# Altium schematic sheet Power_Supply.SchDoc: Power supply
size 420 x 297 mm; Author: G.K.; CompanyName: WUT; DrawnBy: G.K.; Organization: WUT ISE; Address1: Warsaw Univeristy of Technology; Address2: Nowowiejska 15/19; DocumentNumber: 5; Revision: -; SheetNumber: 5; SheetTotal: 6; EDA_Number: ARTIQ; Projet: Booster RF Power Amplifier; ModifiedBy: -; CreateDate: XX/XX/XXXX; CheckedDate: -; Title2: & Power Good detector v1.6; DivGrp: ISE; Designer: G.K.; ModifiedDate: -; ProjectName: Booster RF Power Amplifier
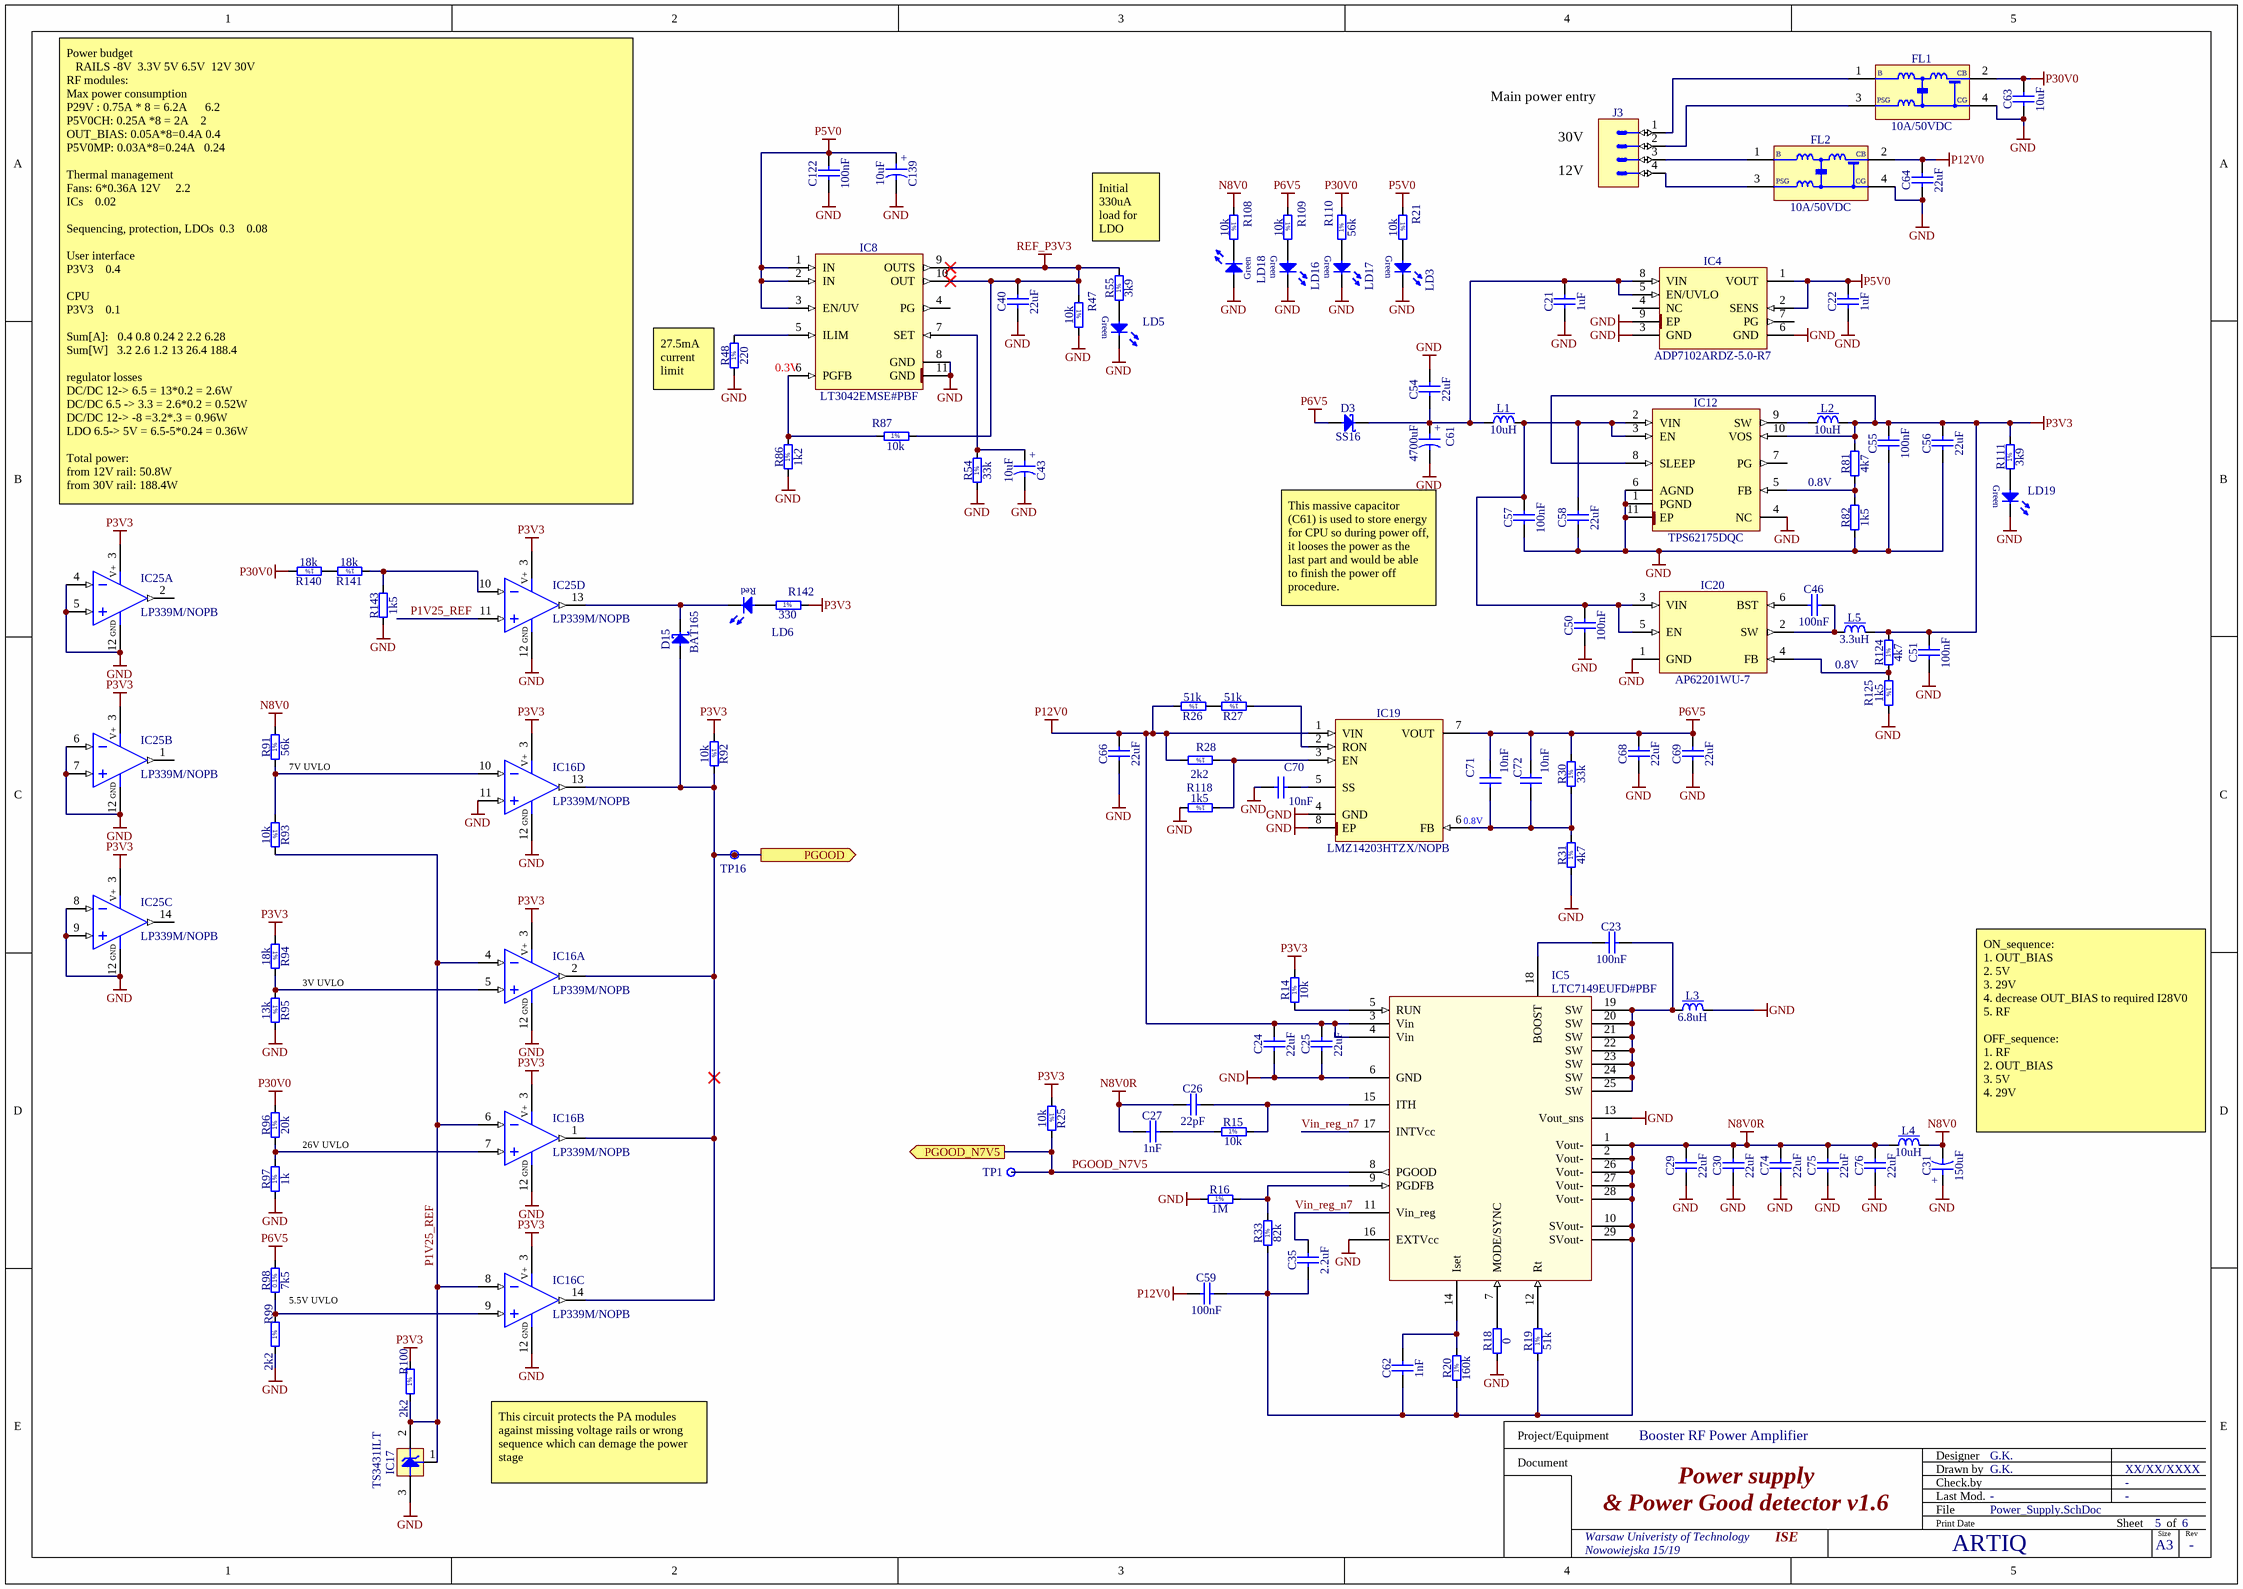
[diagram p0: Power_Supply.SchDoc]

## Parts
C21  1uF  [CAPC2012X110N]
C22  1uF  [CAPC2012X110N]
C23  100nF  [CAPC1005X55N]
C24  22uF  [CAPC2012X135N]
C25  22uF  [CAPC2012X135N]
C26  22pF  [CAPC1005X55N]
C27  1nF  [CAPC1608X87N]
C29  22uF  [CAPC2012X135N]
C30  22uF  [CAPC2012X135N]
C31  150uF  [CAPMP7343X310N]
C35  2.2uF  [CAPC1608X90N]
C40  22uF  [CAPC2012X135N]
C43  10uF  [CAPAE430X540N]
C46  100nF  [CAPC1005X55N]
C50  100nF  [CAPC1005X55N]
C51  100nF  [CAPC1005X55N]
C54  22uF  [CAPC2012X135N]
C55  100nF  [CAPC1005X55N]
C56  22uF  [CAPC2012X135N]
C57  100nF  [CAPC1005X55N]
C58  22uF  [CAPC2012X135N]
C59  100nF  [CAPC1005X55N]
C61  4700uF  [CAPAE1900X1680N]
C62  1nF  [CAPC1608X87N]
C63  10uF  [CAPC3216X190N]
C64  22uF  [CAPC2012X135N]
C66  22uF  [CAPC2012X135N]
C68  22uF  [CAPC2012X135N]
C69  22uF  [CAPC2012X135N]
C70  10nF  [CAPC1608X87N]
C71  10nF  [CAPC1608X87N]
C72  10nF  [CAPC1608X87N]
C74  22uF  [CAPC2012X135N]
C75  22uF  [CAPC2012X135N]
C76  22uF  [CAPC2012X135N]
C122  100nF  [CAPC1005X55N]
C139  10uF  [CAPAE430X540N]
D3  SS16  [DIOM5127X229N]
D15  BAT165  [SOD2512X110N]
FL1  10A/50VDC  [FIL_MURATA_BNX02]
FL2  10A/50VDC  [FIL_MURATA_BNX02]
IC4  ADP7102ARDZ-5.0-R7  [SOIC127P600X175-9N-R241X309]
IC5  LTC7149EUFD#PBF  [QFN50P400X500X80_HS-29N]
IC8  LT3042EMSE#PBF  [SOP50P490X110-11N-R168X198]
IC12  TPS62175DQC  [SON50P200X300X80-11N-R94X250]
IC16  LP339M/NOPB  [SOIC127P600X175-14N]  (parts A,B,C,D of 4)
IC17  TS3431ILT  [SOT95P237X112-3N]
IC19  LMZ14203HTZX/NOPB  [TEXAS_TO-PMOD (NDW)]
IC20  AP62201WU-7  [SOT95P280X100-6N]
IC25  LP339M/NOPB  [SOIC127P600X175-14N]  (parts A,B,C,D of 4)
J3  (no value)  [PHOENIX_1755752]
L1  10uH  [IND_MURATA-PS_8400]
L2  10uH  [IND_MURATA-PS_8400]
L3  6.8uH  [INDM6965X300N]
L4  10uH  [IND_MURATA-PS_8400]
L5  3.3uH  [IND_WURTH_WE-TPC_4828]
LD3  Green  [LED_KINGBRIGHT_KPH-1608CGCK]  (value not drawn)
LD5  Green  [LED_OSRAM_LGL29K]  (value not drawn)
LD6  Hyper Red  [LED_KINGBRIGHT_KPH-1608SURCK]  (value not drawn)
LD16  Green  [LED_KINGBRIGHT_KPH-1608CGCK]  (value not drawn)
LD17  Green  [LED_KINGBRIGHT_KPH-1608CGCK]  (value not drawn)
LD18  Green  [LED_KINGBRIGHT_KPH-1608CGCK]  (value not drawn)
LD19  Green  [LED_OSRAM_LGL29K]  (value not drawn)
R14  10k  [RESC1005X40N]
R15  10k  [RESC1005X40N]
R16  1M  [RESC1005X40N]
R18  0  [RESC1005X40N]
R19  51k  [RESC1005X40N]
R20  160k  [RESC1005X40N]
R21  10k  [RESC1005X40N]
R25  10k  [RESC1005X40N]
R26  51k  [RESC1005X40N]
R27  51k  [RESC1005X40N]
R28  2k2  [RESC1005X40N]
R30  33k  [RESC1608X55N]
R31  4k7  [RESC1608X55N]
R33  82k  [RESC1608X55N]
R47  10k  [RESC1005X40N]
R48  220  [RESC1005X40N]
R54  33k  [RESC1608X55N]
R55  3k9  [RESC1005X40N]
R81  4k7  [RESC1608X55N]
R82  1k5  [RESC1608X55N]
R86  1k2  [RESC1005X40N]
R87  10k  [RESC1005X40N]
R91  56k  [RESC1608X55N]
R92  10k  [RESC1005X40N]
R93  10k  [RESC1005X40N]
R94  18k  [RESC1608X55N]
R95  13k  [RESC1608X55N]
R96  20k  [RESC1608X55N]
R97  1k  [RESC1608X55N]
R98  7k5  [RESC1608X55N]
R99  2k2  [RESC1005X40N]
R100  2k2  [RESC1005X40N]
R108  10k  [RESC1005X40N]
R109  10k  [RESC1005X40N]
R110  56k  [RESC1608X55N]
R111  3k9  [RESC1005X40N]
R118  1k5  [RESC1608X55N]
R124  4k7  [RESC1608X55N]
R125  1k5  [RESC1608X55N]
R140  18k  [RESC1608X55N]
R141  18k  [RESC1608X55N]
R142  330  [RESC1608X55N]
R143  1k5  [RESC1608X55N]
TP1  Test Point  [TPS127]  (value not drawn)
TP16  Test Point  [TPS127]  (value not drawn)

## Ports
PGOOD (out), PGOOD_N7V5 (out)

## Nets
GND: C21.1 C22.1 C24.1 C25.1 C29.1 C30.1 C31.1 C40.1 C43.2 C50.1 C51.1 C54.2 C55.1 C56.1 C57.1 C58.1 C61.2 C63.1 C64.1 C66.1 C68.1 C69.1 C70.1 C74.1 C75.1 C76.1 C122.1 C139.2 FL1.4(CG) FL2.4(CG) IC4.3(GND) IC4.6(GND) IC4.9(EP) IC5.6(GND) IC5.13(Vout_sns) IC5.16(EXTVcc) IC8.8(GND) IC8.11(GND) IC12.1(PGND) IC12.4(NC) IC12.6(AGND) IC12.11(EP) IC16.11(IN+) IC16.12(GND) IC17.3(A) IC19.4(GND) IC19.8(EP) IC20.1(GND) IC25.4(IN-) IC25.5(IN+) IC25.6(IN-) IC25.7(IN+) IC25.8(IN-) IC25.9(IN+) IC25.12(GND) L3.2 LD3.1(C) LD5.1(C) LD16.1(C) LD17.1(C) LD18.2(A) LD19.1(C) R16.1 R18.1 R31.1 R47.2 R48.1 R54.1 R82.1 R86.1 R95.2 R97.1 R99.1 R118.2 R125.2 R143.1
N8V0: C31.2 L4.2 R91.2 R108.1
N8V0R: C26.1 C27.1 C29.2 C30.2 C35.1 C59.2 C62.1 C74.2 C75.2 C76.2 IC5.1(Vout-) IC5.2(Vout-) IC5.10(SVout-) IC5.26(Vout-) IC5.27(Vout-) IC5.28(Vout-) IC5.29(SVout-) L4.1 R19.1 R20.1 R33.1
P3V3: C51.2 C55.2 C56.2 IC12.8(SLEEP) IC12.10(VOS) IC16.3(V+) IC25.3(V+) L2.2 L5.2 R14.2 R25.1 R81.2 R92.1 R94.1 R100.2 R111.2 R124.2 R142.2
P5V0: C22.2 C122.2 C139.1 IC4.1(VOUT) IC4.2(SENS) IC8.1(IN) IC8.2(IN) IC8.3(EN/UV) R21.1
P6V5: C68.2 C69.2 C71.2 C72.2 D3.2(A) IC19.7(VOUT) R30.2 R98.2 R109.1
P12V0: C24.2 C25.2 C59.1 C64.2 C66.2 FL2.2(CB) IC5.3(Vin) IC5.4(Vin) IC19.1(VIN) R26.2 R28.2
P30V0: C63.2 FL1.2(CB) R96.2 R110.2 R140.2
REF_P3V3: C40.2 IC8.9(OUTS) IC8.10(OUT) R47.1 R55.2 R87.2
P1V25_REF: IC16.4(IN-) IC16.6(IN-) IC16.8(IN-) IC17.1(Adj) IC17.2(C) IC25.11(IN+) R93.2 R100.1
PGOOD: D15.2(A) IC16.1(OUT) IC16.2(OUT) IC16.13(OUT) IC16.14(OUT) R92.2 TP16.1 ; port PGOOD
PGOOD_N7V5: IC5.8(PGOOD) R25.2 TP1.1 ; port PGOOD_N7V5
Vin_reg_n7: C35.2 IC5.11(Vin_reg) IC5.17(INTVcc)
NetC21_2: C21.2 C54.1 C61.1 D3.1(C) IC4.5(EN/UVLO) IC4.8(VIN) L1.1
NetC23_1: C23.1 IC5.18(BOOST)
NetC23_2: C23.2 IC5.19(SW) IC5.20(SW) IC5.21(SW) IC5.22(SW) IC5.23(SW) IC5.24(SW) IC5.25(SW) L3.1
NetC26_2: C26.2 IC5.15(ITH) R15.2
NetC27_2: C27.2 R15.1
NetC43_1: C43.1 IC8.7(SET) R54.2
NetC46_1: C46.1 IC20.6(BST)
NetC46_2: C46.2 IC20.2(SW) L5.1
NetC50_2: C50.2 C57.2 C58.2 IC12.2(VIN) IC12.3(EN) IC20.3(VIN) IC20.5(EN) L1.2
NetC62_2: C62.2 IC5.14(Iset) R20.2
NetC70_2: C70.2 IC19.5(SS)
NetC71_1: C71.1 C72.1 IC19.6(FB) R30.1 R31.2
NetD15_1: D15.1(C) IC25.13(OUT) LD6.1(C)
NetFL1_1: FL1.1(B) J3.1
NetFL1_3: FL1.3(PSG) J3.2
NetFL2_1: FL2.1(B) J3.3
NetFL2_3: FL2.3(PSG) J3.4
NetIC5_5: IC5.5(RUN) R14.1
NetIC5_7: IC5.7(MODE/SYNC) R18.2
NetIC5_9: IC5.9(PGDFB) R16.2 R33.2
NetIC5_12: IC5.12(Rt) R19.2
NetIC8_5: IC8.5(ILIM) R48.2
NetIC8_6: IC8.6(PGFB) R86.2 R87.1
NetIC12_5: IC12.5(FB) R81.1 R82.2
NetIC12_9: IC12.9(SW) L2.1
NetIC16_5: IC16.5(IN+) R94.2 R95.1
NetIC16_7: IC16.7(IN+) R96.1 R97.2
NetIC16_9: IC16.9(IN+) R98.1 R99.2
NetIC16_10: IC16.10(IN-) R91.1 R93.1
NetIC19_2: IC19.2(RON) R27.1
NetIC19_3: IC19.3(EN) R28.1 R118.1
NetIC20_4: IC20.4(FB) R124.1 R125.1
NetIC25_10: IC25.10(IN-) R141.1 R143.2
NetLD3_2: LD3.2(A) R21.2
NetLD5_2: LD5.2(A) R55.1
NetLD6_2: LD6.2(A) R142.1
NetLD16_2: LD16.2(A) R109.2
NetLD17_2: LD17.2(A) R110.1
NetLD18_1: LD18.1(C) R108.2
NetLD19_2: LD19.2(A) R111.1
NetR26_1: R26.1 R27.2
NetR140_1: R140.1 R141.2

Not connected (* = marked no-connect by the designer): IC4 4(NC) 7(PG); IC8 4(PG); IC12 7(PG); IC25 1(OUT) 2(OUT) 14(OUT)

## Notes on the sheet
- (near J3) Main power entry
- 12V
- 30V
- (near R55) Initial 330uA load for LDO
- (near R48) 27.5mA current limit
- (near IC8) 0.3V
- Power budget
  RAILS	-8V 	3.3V	5V	6.5V 	12V	30V
  RF modules:
  Max power consumption
  P29V : 0.75A * 8 = 6.2A						6.2
  P5V0CH: 0.25A *8 = 2A				2
  OUT_BIAS: 0.05A*8=0.4A	0.4
  P5V0MP: 0.03A*8=0.24A			0.24
  Thermal management
  Fans: 6*0.36A	12V					2.2
  ICs				0.02
  Sequencing, protection, LDOs		0.3				0.08
  User interface
  P3V3				0.4
  CPU
  P3V3				0.1
  Sum[A]:			0.4	0.8	0.24	2	2.2	6.28
  Sum[W]			3.2	2.6	1.2	13	26.4	188.4
  regulator losses
  DC/DC 12-> 6.5	= 13*0.2 = 2.6W
  DC/DC 6.5 -> 3.3	= 2.6*0.2 = 0.52W
  DC/DC 12-> -8	=3.2*.3 = 0.96W
  LDO 6.5-> 5V	= 6.5-5*0.24 = 0.36W
  Total power:
  from 12V rail: 50.8W
  from 30V rail: 188.4W
- 0.8V
- (near C61) This massive capacitor (C61) is used to store energy for CPU so during power off, it looses the power as the last part and would be able to finish the power off procedure.
- (near R91) 7V UVLO
- 3V UVLO
- ON_sequence:
  1. OUT_BIAS
  2. 5V
  3. 29V
  4. decrease OUT_BIAS to required I28V0
  5. RF
  OFF_sequence:
  1. RF
  2. OUT_BIAS
  3. 5V
  4. 29V
- 26V UVLO
- 5.5V UVLO
- This circuit protects the PA modules against missing voltage rails or wrong sequence which can demage the power stage
- Project/Equipment
- Document
- Designer
- Drawn by
- Check.by
- File
- Last Mod.
- Print Date
- Sheet
- Size
- A3
- of
- Rev
- (in symbol CAE430-540_10UF_16V_20%) +
- (in symbol CAE1900-1680_4700UF_16V_20%) +
- (in symbol CTE7343-31_150UF_16V_10%_LESR0100) +
- (in symbol LED_KINGBRIGHT_KPH-1608SURCK) Red
- (in symbol R0402_1K2_1%_0.0625W_100PPM) 1%
- (in symbol R0402_1M_1%_0.0625W_100PPM) 1%
- (in symbol R0402_2K2_1%_0.0625W_100PPM) 1%
- (in symbol R0402_3K9_1%_0.0625W_100PPM) 1%
- (in symbol R0402_10K_1%_0.0625W_100PPM) 1%
- (in symbol R0402_51K_1%_0.0625W_100PPM) 1%
- (in symbol R0402_160K_1%_0.0625W_100PPM) 1%
- (in symbol R0402_220R_1%_0.0625W_100PPM) 1%
- (in symbol R0603_1K5_1%_0.1W_100PPM) 1%
- (in symbol R0603_1K_1%_0.1W_100PPM) 1%
- (in symbol R0603_4K7_1%_0.1W_100PPM) 1%
- (in symbol R0603_7K5_0.1%_0.063W_10PPM) 0.1%
- (in symbol R0603_13K_1%_0.1W_100PPM) 1%
- (in symbol R0603_18K_1%_0.1W_100PPM) 1%
- (in symbol R0603_20K_1%_0.1W_100PPM) 1%
- (in symbol R0603_33K_1%_0.1W_100PPM) 1%
- (in symbol R0603_56K_1%_0.1W_100PPM) 1%
- (in symbol R0603_82K_1%_0.1W_100PPM) 1%
- (in symbol R0603_330R_1%_0.1W_100PPM) 1%

## Library data of the parts
C21 C22 = CC0805_1UF_50V_10%_X7R: Non-polarised capacitor; Part Description: SMD Multilayer Chip Ceramic Capacitor; Manufacturer: GENERIC; Manufacturer1 Part Number: C0805C105K5RACTU; Voltage: 50V; TC: X7R; Tolerance: ±10%; Part Number: CC0805_1UF_50V_10%_X7R; Component Kind: Standard; Component Type: Standard; Pin Count: 2; Value: 1uF; Status: Preferred; Manufacturer Part Number: CC0805_1UF_50V_10%_X7R; Case: 0805; Mounted: Yes; Socket: No; SMD: Yes; Sense: No; Manufacturer1 Example: KEMET; Manufacturer1 ComponentHeight: 1.1mm; HelpURL: \\cern.ch\dfs\Applications\Altium\Datasheets\CC0805_X7R_KEMET.pdf; Author: CERN DEM JLC; CreateDate: 04.12.2013; LatestRevisionDate: 04.12.2013
C23 C59 = CC0402_100NF_50V_10%_X7R: Non-polarised capacitor; Part Description: SMD Multilayer Chip Ceramic Capacitor; Manufacturer: GENERIC; Manufacturer1 Part Number: GRM155R71H104KE14D; Voltage: 50V; TC: X7R; Tolerance: ±10%; Part Number: CC0402_100NF_50V_10%_X7R; Component Kind: Standard; Component Type: Standard; Pin Count: 2; Value: 100nF; Status: None; Manufacturer Part Number: CC0402_100NF_50V_10%_X7R; Case: 0402; Mounted: Yes; Socket: No; SMD: Yes; Sense: No; Manufacturer1 Example: MURATA; Manufacturer1 ComponentHeight: 0.55mm; HelpURL: \\cern.ch\dfs\Applications\Altium\Datasheets\CC0402_MURATA_GRM155R71H104KE14D.pdf; Author: CERN DEM MR; CreateDate: 30.06.2017; LatestRevisionDate: 30.06.2017
C24 C25 C29 C30 C40 C54 C56 C58 C64 C66 C68 C69 C74-C76 = CC0805_22UF_16V_10%_X5R: Non-polarised capacitor; Part Description: SMD Multilayer Chip Ceramic Capacitor; Manufacturer: GENERIC; Manufacturer1 Part Number: C2012X5R1C226KT; Voltage: 16V; TC: X5R; Tolerance: ±10%; Part Number: CC0805_22UF_16V_10%_X5R; Component Kind: Standard; Component Type: Standard; Pin Count: 2; Value: 22uF; Status: Preferred; Manufacturer Part Number: CC0805_22UF_16V_10%_X5R; Case: 0805; Mounted: Yes; Socket: No; SMD: Yes; Sense: No; Manufacturer1 Example: TDK; Manufacturer1 ComponentHeight: 1.35mm; HelpURL: \\cern.ch\dfs\Applications\Altium\Datasheets\CC0805_X5R_TDK_C.pdf; Author: CERN DEM JLC; CreateDate: 25.10.2012; LatestRevisionDate: 25.10.2012
C26 = CC0402_22PF_50V_5%_C0G: Non-polarised capacitor; Part Description: SMD Multilayer Chip Ceramic Capacitor; Manufacturer: GENERIC; Manufacturer1 Part Number: C0402C220J5GACTU; Voltage: 50V; TC: C0G/NP0; Tolerance: ±5%; Part Number: CC0402_22PF_50V_5%_C0G; Component Kind: Standard; Component Type: Standard; Pin Count: 2; Value: 22pF; Status: Preferred; Manufacturer Part Number: CC0402_22PF_50V_5%_C0G; Case: 0402; Mounted: Yes; Socket: No; SMD: Yes; Sense: No; Manufacturer1 Example: KEMET; Manufacturer1 ComponentHeight: 0.55mm; HelpURL: \\cern.ch\dfs\Applications\Altium\Datasheets\CC0805_C0G_KEMET_(Commercial Grade).pdf; Author: CERN DEM JLC; CreateDate: 03.12.2007; LatestRevisionDate: 03.12.2007
C27 C62 = CC0603_1NF_50V_10%_X7R: Non-polarised capacitor; Part Description: SMD Multilayer Chip Ceramic Capacitor; Manufacturer: GENERIC; Manufacturer1 Part Number: 223858615623; Voltage: 50V; TC: X7R; Tolerance: ±10%; Part Number: CC0603_1NF_50V_10%_X7R; Component Kind: Standard; Component Type: Standard; Pin Count: 2; Value: 1nF; Status: Preferred; Manufacturer Part Number: CC0603_1NF_50V_10%_X7R; Case: 0603; Mounted: Yes; Socket: No; SMD: Yes; Sense: No; Manufacturer1 Example: PHYCOMP; Manufacturer1 ComponentHeight: 0.87mm; HelpURL: \\cern.ch\dfs\Applications\Altium\Datasheets\CC0603_X7R_PHYCOMP.pdf; Author: CERN DEM JLC; CreateDate: 03.12.2007; LatestRevisionDate: 03.12.2007
C31 = CTE7343-31_150UF_16V_10%_LESR0100: Polarised capacitor; Part Description: Low ESR 0R1 Solid Tantalum Chip Capacitor; Manufacturer: GENERIC; Manufacturer1 Part Number: TPSD157K016R0100; Voltage: 16V; Tolerance: ±10%; Part Number: CTE7343-31_150UF_16V_10%_LESR0100; Component Kind: Standard; Component Type: Standard; Pin Count: 2; Value: 150uF; Status: Preferred; Manufacturer Part Number: CTE7343-31_150UF_16V_10%_LESR0100; Case: D; Mounted: Yes; Socket: No; SMD: Yes; Sense: No; Manufacturer1 Example: AVX; Manufacturer1 ComponentHeight: 3.1mm; HelpURL: \\cern.ch\dfs\Applications\Altium\Datasheets\CTE-LESR_AVX_TPS.pdf; Author: CERN DEM JLC; CreateDate: 05.05.2008; LatestRevisionDate: 20.01.2009
C35 = CC0603_2.2UF_10V_20%_X7R: Non-polarised capacitor; Part Description: SMD Multilayer Chip Ceramic Capacitor; Manufacturer: GENERIC; Manufacturer1 Part Number: LMK107B7225MA-T; Voltage: 10V; TC: X7R; Tolerance: ±20%; Part Number: CC0603_2.2UF_10V_20%_X7R; Component Kind: Standard; Component Type: Standard; Pin Count: 2; Value: 2.2uF; Status: Not Recommended; Manufacturer Part Number: CC0603_2.2UF_10V_20%_X7R; Case: 0603; Mounted: Yes; Socket: No; SMD: Yes; Sense: No; Manufacturer1 Example: TAIYO YUDEN; Manufacturer1 ComponentHeight: 0.9mm; HelpURL: \\cern.ch\dfs\Applications\Altium\Datasheets\CC0603_X7R_TAIYO-YUDEN_HIGH-VALUE.pdf; Author: CERN DEM JLC; CreateDate: 22.06.2011; LatestRevisionDate: 27.06.2011
C43 C139 = CAE430-540_10UF_16V_20%: Polarised capacitor; Part Description: Aluminum Electrolytic SMT Capacitor; Manufacturer: PANASONIC; Manufacturer Part Number: EEEFK1C100AR; Voltage: 16V; Tolerance: ±20%; Part Number: CAE430-540_10UF_16V_20%; Component Kind: Standard; Component Type: Standard; Pin Count: 2; Value: 10uF; Status: Not Recommended; Case: B; Mounted: Yes; Socket: No; SMD: Yes; Sense: No; ComponentHeight: 5.8mm; HelpURL: \\cern.ch\dfs\Applications\Altium\Datasheets\CAE_PANASONIC_FK.pdf; Author: CERN DEM JLC; CreateDate: 03.12.2007; LatestRevisionDate: 05.11.2014
C46 C50 C55 C57 C122 = CC0402_100NF_16V_10%_X7R: Non-polarised capacitor; Part Description: SMD Multilayer Chip Ceramic Capacitor; Manufacturer: GENERIC; Manufacturer1 Part Number: GRM155R71C104KA88D; Voltage: 16V; TC: X7R; Tolerance: ±10%; Part Number: CC0402_100NF_16V_10%_X7R; Component Kind: Standard; Component Type: Standard; Pin Count: 2; Value: 100nF; Status: Not Recommended; Manufacturer Part Number: CC0402_100NF_16V_10%_X7R; Case: 0402; Mounted: Yes; Socket: No; SMD: Yes; Sense: No; Manufacturer1 Example: MURATA; Manufacturer1 ComponentHeight: 0.55mm; HelpURL: \\cern.ch\dfs\Applications\Altium\Datasheets\CC0402_X7R_MURATA_GRM.pdf; Author: CERN DEM JLC; CreateDate: 05.12.2013; LatestRevisionDate: 03.12.2007
C51 = CC0402_100NF_16V_10%_X5R: Non-polarised capacitor; Part Description: SMD Multilayer Chip Ceramic Capacitor; Manufacturer: GENERIC; Manufacturer1 Part Number: GRM155R61C104KA88D; Voltage: 16V; TC: X5R; Tolerance: ±10%; Part Number: CC0402_100NF_16V_10%_X5R; Component Kind: Standard; Component Type: Standard; Pin Count: 2; Value: 100nF; Status: None; Manufacturer Part Number: CC0402_100NF_16V_10%_X5R; Case: 0402; Mounted: Yes; Socket: No; SMD: Yes; Sense: No; Manufacturer1 Example: MURATA; Manufacturer1 ComponentHeight: 0.55mm; HelpURL: \\cern.ch\dfs\Applications\Altium\Datasheets\CC0402_X5R_MURATA_GRM.pdf; Author: CERN DEM JLC; CreateDate: 10.12.2013; LatestRevisionDate: 10.12.2013
C61 = CAE1900-1680_4700UF_16V_20%: Polarised capacitor; Part Description: Aluminum Electrolytic SMT Capacitor; Manufacturer: PANASONIC; Manufacturer Part Number: EEVFK1C472M; Voltage: 16V; Tolerance: ±20%; Part Number: CAE1900-1680_4700UF_16V_20%; Component Kind: Standard; Component Type: Standard; Pin Count: 2; Value: 4700uF; Status: Not Recommended; Case: K16; Mounted: Yes; Socket: No; SMD: Yes; Sense: No; ComponentHeight: 16.8mm; HelpURL: \\cern.ch\dfs\Applications\Altium\Datasheets\CAE_PANASONIC_FK.pdf; Author: CERN DEM JLC; CreateDate: 05.11.2014; LatestRevisionDate: 05.11.2014
C63 = CC1206_10UF_50V_10%_X5R_TDK_CGA5L3X5R1H106K160AB: Non-polarised capacitor; Part Description: SMD Multilayer Chip Ceramic Capacitor (Automotive Grade); Manufacturer: TDK; Voltage: 50V; TC: X5R; Tolerance: ±10%; Part Number: CC1206_10UF_50V_10%_X5R_TDK_CGA5L3X5R1H106K160AB; Component Kind: Standard; Component Type: Standard; Pin Count: 2; Value: 10uF; Status: Not Recommended; Manufacturer Part Number: CGA5L3X5R1H106K160AB; Case: 1206; Mounted: Yes; Socket: No; SMD: Yes; Sense: No; ComponentHeight: 1.9mm; HelpURL: \\cern.ch\dfs\Applications\Altium\Datasheets\CC1206_X5R_TDK_CGA.pdf; Author: CERN DEM BC; CreateDate: 29.02.2016; LatestRevisionDate: 13.09.2016
C70-C72 = CC0603_10NF_50V_5%_C0G: Non-polarised capacitor; Part Description: SMD Multilayer Chip Ceramic Capacitor; Manufacturer: GENERIC; Manufacturer1 Part Number: C1608C0G1H103J080AA; Voltage: 50V; TC: C0G/NP0; Tolerance: ±5%; Part Number: CC0603_10NF_50V_5%_C0G; Component Kind: Standard; Component Type: Standard; Pin Count: 2; Value: 10nF; Status: Preferred; Manufacturer Part Number: CC0603_10NF_50V_5%_C0G; Case: 0603; Mounted: Yes; Socket: No; SMD: Yes; Sense: No; Manufacturer1 Example: TDK; Manufacturer1 ComponentHeight: 0.9mm; HelpURL: \\cern.ch\dfs\Applications\Altium\Datasheets\CC0603_C0G_TDK_C.pdf; Author: CERN DEM JLC; CreateDate: 10.12.2014; LatestRevisionDate: 10.12.2014
D3 = SS16: Schottky Diode; Part Description: Surface Mount Schottky Barrier Rectifier; Manufacturer: VISHAY GENERAL SEMICONDUCTOR; Voltage: 60V; Power: 1A; PressFit: No; Bonding: No; Part Number: SS16; Component Kind: Standard; Component Type: Standard; Device: SS16; PackageDescription: DO-214-AC Molded Diode, Body 5.1x2.7mm, IPC Medium Density; Manufacturer Part Number: SS16; Pin Count: 2; Case: DO-214AC; Mounted: Yes; Socket: No; SMD: Yes; Sense: No; ComponentHeight: 2.29mm; HelpURL: \\cern.ch\dfs\Applications\Altium\Datasheets\SS16.pdf; Author: CERN DEM JLC; CreateDate: 15.07.2008; LatestRevisionDate: 23.08.2010
D15 = BAT165: Schottky Diode; Part Description: Medium Power AF Schottky Diode; Manufacturer: INFINEON; Voltage: 40V; Power: 750mA; PressFit: No; Bonding: No; Part Number: BAT165; Component Kind: Standard; Component Type: Standard; Device: BAT165; PackageDescription: Small Outline Diode Flat Lead (SOD-323), 1.70mm W X 1.25mm L X 1.10mm H body,  IPC Medium Density; Manufacturer Part Number: BAT165; Pin Count: 2; Case: SOD323; Mounted: Yes; Socket: No; SMD: Yes; Sense: No; ComponentHeight: 1.1mm; HelpURL: \\cern.ch\dfs\Applications\Altium\Datasheets\BAT165.pdf; Author: CERN DEM JLC; CreateDate: 12.11.2014; LatestRevisionDate: 12.11.2014
FL1 FL2 = FIL_MURATA_BNX022-01L: Block Type EMIFIL (LC Combined); Part Description: Block Type EMIFIL (LC Combined) SMD Type, BNX02* Series; Manufacturer: MURATA; Resistance: 0.5R; Part Number: FIL_MURATA_BNX022-01L; Component Kind: Standard; Component Type: Standard; Pin Count: 2; Value: 10A/50VDC; Status: None; Manufacturer Part Number: BNX022-01L; Mounted: Yes; Socket: No; SMD: Yes; Sense: No; ComponentHeight: 3.3mm; HelpURL: \\cern.ch\dfs\Applications\Altium\Datasheets\FIL_MURATA_BNX022-01L.pdf; Author: CERN DEM JLC; CreateDate: 10.10.2012; LatestRevisionDate: 10.10.2012
IC4 = ADP7102ARDZ-5.0-R7: 300 mA, Low Noise, CMOS LDO Linear Regulator; Part Description: 5V, 300mA, Low Noise, CMOS LDO Linear Regulator; Manufacturer: ANALOG DEVICES; PressFit: No; Bonding: No; Part Number: ADP7102ARDZ-5.0-R7; Component Kind: Standard; Component Type: Standard; Device: ADP7102ARDZ-5.0-R7; PackageDescription: SOIC 8, Pitch 1.27mm - Body 3.9x4.9mm, (w/thermal tab 2.41mm X 3.098mm), IPC Medium Density; Manufacturer Part Number: ADP7102ARDZ-5.0-R7; Pin Count: 8; Case: SOIC8; Mounted: Yes; Socket: No; SMD: Yes; Sense: No; ComponentHeight: 1.75mm; HelpURL: \\cern.ch\dfs\Applications\Altium\Datasheets\ADP7102ARDZ-5.0-R7.pdf; Author: CERN DEM JLC; CreateDate: 17.03.2014; LatestRevisionDate: 17.03.2014
IC5 = LTC7149EUFD#PBF: LTC7149 - 60V, 4A Synchronous Step-Down Regulator for Inverting Outputs; Manufacturer: Linear technology; Manufacturer Part Number: LTC7149EUFD#PBF
IC8 = LT3042EMSE#PBF: 20V, 200mA, Ultralow Noise, Ultrahigh PSRR RF Linear Regulator; Manufacturer: LINEAR TECHNOLOGY; PressFit: No; Bonding: No; Part Number: LT3042EMSE#PBF; Component Kind: Standard; Component Type: Standard; Device: LT3042EMSE#PBF; PackageDescription: SOP, 0.50mm, Pitch; 10 pin, 3.00mm W X 3.00mm L X 1.10mm H body (w/thermal tab  1.68 X 1.98 mm), IPC Medium Density; Part Description: 20V, 200mA, Ultralow Noise, Ultrahigh PSRR RF Linear Regulator; Manufacturer Part Number: LT3042EMSE#PBF; Pin Count: 11; Case: MSOP10; Mounted: Yes; Socket: No; SMD: Yes; Sense: No; ComponentHeight: 1.1mm; HelpURL: \\cern.ch\dfs\Applications\Altium\Datasheets\LT3042EMSE#PBF.pdf; Author: CERN DEM MR; CreateDate: 09.06.2016; LatestRevisionDate: 09.06.2016
IC12 = TPS62175DQC: 4.75-28VDC to 1-6VDC, 500mA Step-Down Converter With Sleep Mode; Manufacturer: TEXAS INSTRUMENTS; PressFit: No; Bonding: No; Part Number: TPS62175DQC; Component Kind: Standard; Component Type: Standard; Device: TPS62175DQC; PackageDescription: SON, 10-Leads, Body 2x3mm, Pitch 0.5mm, Thermal Pad 0.94x2.5mm, IPC Medium Density; Part Description: 4.75-28VDC to 1-6VDC, 500mA Step-Down Converter With Sleep Mode; Manufacturer Part Number: TPS62175DQC; Pin Count: 11; Case: SON10; Mounted: Yes; Socket: No; SMD: Yes; Sense: No; ComponentHeight: 0.8mm; HelpURL: \\cern.ch\dfs\Applications\Altium\Datasheets\TPS62175DQC.pdf; Author: CERN DEM JMW; CreateDate: 11.08.2015; LatestRevisionDate: 11.08.2015
IC16 IC25 = LP339M/NOPB: Quad Operational Amplifier; Part Description: Ultra-Low Power Quad Comparator; Manufacturer: TEXAS INSTRUMENTS; PressFit: No; Bonding: No; Part Number: LP339M/NOPB; Component Kind: Standard; Component Type: Standard; Device: LP339M/NOPB; PackageDescription: SOIC 14, Pitch 1.27mm - Body 4x8.75mm, IPC Medium Density; Manufacturer Part Number: LP339M/NOPB; Pin Count: 14; Case: SOIC14; Mounted: Yes; Socket: No; SMD: Yes; Sense: No; ComponentHeight: 1.75mm; Author: CERN DEM MR; HelpURL: \\cern.ch\dfs\Applications\Altium\Datasheets\LP339M-NOPB.pdf; CreateDate: 23.03.2016; LatestRevisionDate: 23.03.2016
IC17 = TS3431ILT: Precision Reference 1=Adj 2=Cathode 3=Anode; Part Description: 1.24 V Programmable Shunt Voltage Reference; Manufacturer: ST MICROELECTRONICS; PressFit: No; Bonding: No; Part Number: TS3431ILT; Component Kind: Standard; Component Type: Standard; Device: TS3431ILT; PackageDescription: SOT, 0.95mm, pitch; 3 pin,1.30mm W X 2.92mm L X 1.12mm H body, IPC Medium Density; Manufacturer Part Number: TS3431ILT; Pin Count: 3; Case: SOT23; Mounted: Yes; Socket: No; SMD: Yes; Sense: No; ComponentHeight: 1.12mm; HelpURL: \\cern.ch\dfs\Applications\Altium\Datasheets\TS3431ILT.pdf; Author: CERN DEM JLC; CreateDate: 17.11.2016; LatestRevisionDate: 17.11.2016
IC19 = PM_LMZ14203: 3A SIMPLE SWITCHER® Power Module with 42V Maximum Input Voltage; Manufacturer: TEXAS INSTRUMENTS; PressFit: No; Bonding: No; Part Number: LMZ14203HTZX/NOPB; Component Kind: Standard; Component Type: Standard; Device: LMZ14203HTZX/NOPB; PackageDescription: TO-PMOD 7 Pin Package, NATIONAL Package TZA07A, 1.70mm pitch; 9.85mm L X 10.16mm W X 4.67mm H body; Part Description: 3A SIMPLE SWITCHER® Power Module with 42V Maximum Input Voltage; Manufacturer Part Number: LMZ14203HTZX/NOPB; Pin Count: 8; Case: TO-PMOD-7; Mounted: Yes; Socket: No; SMD: Yes; Sense: No; ComponentHeight: 4.67mm; HelpURL: \\cern.ch\dfs\Applications\Altium\Datasheets\LMZ14201EXTTZE-NOPB.pdf; Author: GK; CreateDate: 17.11.2016; LatestRevisionDate: 17.11.2016
IC20 = AP62201WU-7: 4.2V TO 18V INPUT, 2A LOW IQ SYNCHRONOUS BUCK CONVERTER; Manufacturer: DIODES INCORPORATED; PressFit: No; Bonding: No; Part Number: AP62201WU-7; Component Kind: Standard; Component Type: Standard; Device: AP62201WU-7; PackageDescription: SOT23, 0.95mm Pitch; 6 Pin, 1.625mm W X 2.90mm L X 1.00mm H body, IPC Medium Density; Part Description: 4.2V TO 18V INPUT, 2A LOW IQ SYNCHRONOUS BUCK CONVERTER; Manufacturer Part Number: AP62201WU-7; Pin Count: 6; Case: SOT23-6; Mounted: Yes; Socket: No; SMD: Yes; Sense: No; ComponentHeight: 1.1mm; HelpURL: \\cern.ch\dfs\Applications\Altium\Datasheets\AP6220x.pdf; Author: CERN DEM HF; CreateDate: 07.01.2022; LatestRevisionDate: 07.01.2022
J3 = PHOENIX_1755752: Connector 4 Male; Part Description: 12A, 250V, Pitch 5.08mm, 4 Positions Header; Manufacturer: PHOENIX CONTACT; Manufacturer Part Number: 1755752 (MSTBVA 2,5/ 4-G-5,08); PressFit: No; Part Number: PHOENIX_1755752; Component Kind: Standard; Component Type: Standard; Pin Count: 4; Mounted: Yes; Socket: No; SMD: No; Sense: No; Status: None; ComponentHeight: 12mm; HelpURL: \\cern.ch\dfs\Applications\Altium\Datasheets\PHOENIX_1755752.pdf; Author: CERN DEM JLC; CreateDate: 27.11.2012; LatestRevisionDate: 27.11.2012
L1 L2 L4 = IND_10UH_10%_MURATA-PS_8400: Inductor With Core; Part Description: Miniature Surface Mount Power Inductor (8400 Serie); Manufacturer: MURATA POWER SOLUTIONS; Manufacturer Part Number: 84103C; Power: 950mA; Resistance: 0.24R; Tolerance: ±10%; Part Number: IND_10UH_10%_MURATA-PS_8400; Component Kind: Standard; Component Type: Standard; Pin Count: 2; Value: 10uH; Status: None; Mounted: Yes; Socket: No; SMD: Yes; Sense: No; ComponentHeight: 2.9mm; HelpURL: \\cern.ch\dfs\Applications\Altium\Datasheets\IND_MURATA-PS_8400.pdf; Author: CERN DEM JLC; CreateDate: 02.07.2012; LatestRevisionDate: 02.07.2012
L3 = IND2525_1.5UH_20%_VISHAY_IHLP-2525CZ: Inductor With Core; Part Number: IND2525_6.8UH_20%_VISHAY_IHLP-2525CZ; Part Description: Low Profile, High Current IHLP® Inductor; Manufacturer: VISHAY DALE; Manufacturer Part Number: IHLP2525CZER6R8M01; Power: 9A; Resistance: 0.014R; Tolerance: ±20%; Note: Replace with IHLP2525CZER6R8M01; Component Kind: Standard; Component Type: Standard; Pin Count: 2; Value: 6.8uH; Status: None; Case: 2525; Mounted: Yes; Socket: No; SMD: Yes; Sense: No; ComponentHeight: 3mm; HelpURL: \\cern.ch\dfs\Applications\Altium\Datasheets\IND2525_VISHAY_IHLP-2525CZ.pdf; Author: CERN DEM JLC; CreateDate: 24.10.2012; LatestRevisionDate: 24.10.2012
L5 = IND_3.3UH_30%_WURTH_WE-TPC_744043003: Inductor With Core; Part Description: Shielded Tiny Power Inductor (WE-TPC Serie); Manufacturer: WURTH ELEKTRONIK; Power: 2.15A; Resistance: 0.03R; Tolerance: ±30%; Part Number: IND_3.3UH_30%_WURTH_WE-TPC_744043003; Component Kind: Standard; Component Type: Standard; Pin Count: 2; Value: 3.3uH; Manufacturer Part Number: 744043003; Mounted: Yes; Socket: No; SMD: Yes; Sense: No; ComponentHeight: 3mm; HelpURL: \\cern.ch\dfs\Applications\Altium\Datasheets\IND_WURTH_WE-TPC_744043003.pdf; Author: CERN DEM JLC; CreateDate: 12.07.2011; LatestRevisionDate: 24.01.2012
LD3 LD16-LD18 = LED_KINGBRIGHT_KPH-1608CGCK: LED Green 1C 2A; Part Description: SMD Green LED, Case 1.6mmX0.8mm(0603), 0.65mm Thickness; PressFit: No; Bonding: No; Part Number: LED_KINGBRIGHT_KPH-1608CGCK; Component Kind: Standard; Component Type: Standard; Color: Green; PackageDescription: SMT Green LED, Case 0603, Body L 1.6 x W 0.8mm H 0.65mm; Manufacturer: KINGBRIGHT; Manufacturer Part Number: KPH-1608CGCK; Pin Count: 2; Mounted: Yes; Socket: No; SMD: Yes; Sense: No; ComponentHeight: 0.65mm; HelpURL: \\cern.ch\dfs\Applications\Altium\Datasheets\LED_KINGBRIGHT_KPH-1608CGCK.pdf; Author: CERN DEM JLC; CreateDate: 03.07.2017; LatestRevisionDate: 03.07.2017
LD5 LD19 = LED_OSRAM_LG L29K-G2J1-24-Z: LED Green 1C 2A; Part Description: Surface Mount Green LED (0603 Case); Manufacturer: OSRAM; PressFit: No; Bonding: No; Part Number: LED_OSRAM_LG L29K-G2J1-24-Z; Component Kind: Standard; Component Type: Standard; Color: Green; PackageDescription: Green Chip LED, 2-Leads, Body 1.7x0.8mm, IPC Medium Density; Manufacturer Part Number: LG L29K-G2J1-24-Z; Pin Count: 2; Case: 0603; Mounted: Yes; Socket: No; SMD: Yes; Sense: No; ComponentHeight: 0.67mm; HelpURL: \\cern.ch\dfs\Applications\Altium\Datasheets\LED_OSRAM_LGL29K.pdf; Author: CERN DEM JLC; CreateDate: 24.04.2012; LatestRevisionDate: 24.04.2012
LD6 = LED_KINGBRIGHT_KPH-1608SURCK: LED Red 1C 2A; Part Description: SMD Hyper Red LED, Case 1.6mmX0.8mm(0603), 0.65mm Thickness; PressFit: No; Bonding: No; Part Number: LED_KINGBRIGHT_KPH-1608SURCK; Component Kind: Standard; Component Type: Standard; Color: Hyper Red; PackageDescription: SMT Hyper Red LED, Case 0603, Body L 1.6 x W 0.8mm H 0.65mm; Manufacturer: KINGBRIGHT; Manufacturer Part Number: KPH-1608SURCK; Pin Count: 2; Mounted: Yes; Socket: No; SMD: Yes; Sense: No; ComponentHeight: 0.65mm; HelpURL: \\cern.ch\dfs\Applications\Altium\Datasheets\LED_KINGBRIGHT_KPH-1608SURCK.pdf; Author: CERN DEM JLC; CreateDate: 03.07.2017; LatestRevisionDate: 03.07.2017
R14 R15 = R0402_10K_1%_0.0625W_100PPM: Resistor - 1%; Part Description: General Purpose Thick Film Chip Resistor; Manufacturer: GENERIC; Manufacturer1 Part Number: 232270671003L; TC: ±100ppm/°C; Part Number: R0402_10K_1%_0.0625W_100PPM; Component Kind: Standard; Component Type: Standard; Pin Count: 2; Value: 10k; Status: Not recommended; Power: 0.0625W; Tolerance: ±1%; Manufacturer Part Number: R0402_10K_1%_0.0625W_100PPM; Case: 0402; Mounted: Yes; Sense: No; Socket: No; SMD: Yes; Manufacturer1 Example: YAGEO PHYCOMP; Manufacturer1 ComponentHeight: 0.4mm; HelpURL: \\cern.ch\dfs\Applications\Altium\Datasheets\R0402_Phycomp_RC0402.pdf; Author: CERN DEM JLC; CreateDate: 03.12.2007; LatestRevisionDate: 17.10.2012
R16 = R0402_1M_1%_0.0625W_100PPM: Resistor - 1%; Part Description: General Purpose Thick Film Chip Resistor; Manufacturer: GENERIC; Manufacturer1 Part Number: 232270671005L; TC: ±100ppm/°C; Part Number: R0402_1M_1%_0.0625W_100PPM; Component Kind: Standard; Component Type: Standard; Pin Count: 2; Value: 1M; Status: Not recommended; Power: 0.0625W; Tolerance: ±1%; Manufacturer Part Number: R0402_1M_1%_0.0625W_100PPM; Case: 0402; Mounted: Yes; Sense: No; Socket: No; SMD: Yes; Manufacturer1 Example: YAGEO PHYCOMP; Manufacturer1 ComponentHeight: 0.4mm; HelpURL: \\cern.ch\dfs\Applications\Altium\Datasheets\R0402_Phycomp_RC0402.pdf; Author: CERN DEM JLC; CreateDate: 03.12.2007; LatestRevisionDate: 17.10.2012
R18 = R0402_0R_JUMPER: Resistor; Part Description: 1A (0.05R Max DC Resistance) Zero Ohm Jumper; Manufacturer: GENERIC; Manufacturer1 Part Number: 232270591001L; Mounted: No; Part Number: R0402_0R_JUMPER; Component Kind: Standard; Component Type: Standard; Pin Count: 2; Value: 0; Status: Not recommended; Manufacturer Part Number: R0402_0R_JUMPER; Case: 0402; Sense: No; Socket: No; SMD: Yes; Manufacturer1 Example: YAGEO PHYCOMP; Manufacturer1 ComponentHeight: 0.4mm; HelpURL: \\cern.ch\dfs\Applications\Altium\Datasheets\R0402_Phycomp_RC0402.pdf; Author: CERN DEM JLC; CreateDate: 03.12.2007; LatestRevisionDate: 17.10.2012
R19 R27 = R0402_51K_1%_0.0625W_100PPM: Resistor - 1%; Part Description: General Purpose Thick Film Chip Resistor; Manufacturer: GENERIC; Manufacturer1 Part Number: 232270674703L; TC: ±100ppm/°C; Part Number: R0402_51K_1%_0.0625W_100PPM; Component Kind: Standard; Component Type: Standard; Pin Count: 2; Value: 51k; Status: Not recommended; Power: 0.0625W; Tolerance: ±1%; Manufacturer Part Number: R0402_51K_1%_0.0625W_100PPM; Case: 0402; Mounted: Yes; Sense: No; Socket: No; SMD: Yes; Manufacturer1 Example: YAGEO PHYCOMP; Manufacturer1 ComponentHeight: 0.4mm; HelpURL: \\cern.ch\dfs\Applications\Altium\Datasheets\R0402_Phycomp_RC0402.pdf; Author: CERN DEM JLC; CreateDate: 03.12.2007; LatestRevisionDate: 17.10.2012
R20 = R0402_160K_1%_0.0625W_100PPM: Resistor - 1%; Part Description: General Purpose Thick Film Chip Resistor; Manufacturer: GENERIC; Manufacturer1 Part Number: 232270671604L; TC: ±100ppm/°C; PressFit: No; Part Number: R0402_160K_1%_0.0625W_100PPM; Component Kind: Standard; Component Type: Standard; Pin Count: 2; Value: 160k; Status: Not Recommended; Power: 0.0625W; Tolerance: ±1%; Manufacturer Part Number: R0402_160K_1%_0.0625W_100PPM; Case: 0402; Mounted: Yes; Sense: No; Socket: No; SMD: Yes; Manufacturer1 Example: YAGEO PHYCOMP; Manufacturer1 ComponentHeight: 0.4mm; HelpURL: \\cern.ch\dfs\Applications\Altium\Datasheets\R0402_Phycomp_RC0402.pdf; Author: CERN DEM JLC; CreateDate: 03.12.2007; LatestRevisionDate: 17.10.2012
R21 R25 R47 R87 R92 R93 R108 R109 = R0402_10K_1%_0.0625W_100PPM: Resistor - 1%; Part Description: General Purpose Thick Film Chip Resistor; Manufacturer: GENERIC; Manufacturer1 Part Number: 232270671003L; TC: ±100ppm/°C; Table: Resistors SMD; Part Number: R0402_10K_1%_0.0625W_100PPM; Component Kind: Standard; Component Type: Standard; Pin Count: 2; Value: 10k; Status: Not recommended; Power: 0.0625W; Tolerance: ±1%; Manufacturer Part Number: R0402_10K_1%_0.0625W_100PPM; Case: 0402; Mounted: Yes; Socket: No; SMD: Yes; Manufacturer1 Example: YAGEO PHYCOMP; Manufacturer1 ComponentHeight: 0.4mm; HelpURL: \\cern.ch\dfs\Applications\Altium\Datasheets\R0402_Phycomp_RC0402.pdf; Author: CERN DEM JLC; CreateDate: 2007-12-03; LatestRevisionDate: 2012-10-17
R26 = R0402_51K_1%_0.0625W_100PPM: Resistor - 1%; Part Description: General Purpose Thick Film Chip Resistor; Manufacturer: GENERIC; Manufacturer1 Part Number: 232270674703L; TC: ±100ppm/°C; PressFit: No; Part Number: R0402_51K_1%_0.0625W_100PPM; Component Kind: Standard; Component Type: Standard; Pin Count: 2; Value: 51k; Status: Not Recommended; Power: 0.0625W; Tolerance: ±1%; Manufacturer Part Number: R0402_51K_1%_0.0625W_100PPM; Case: 0402; Mounted: Yes; Sense: No; Socket: No; SMD: Yes; Manufacturer1 Example: YAGEO PHYCOMP; Manufacturer1 ComponentHeight: 0.4mm; HelpURL: \\cern.ch\dfs\Applications\Altium\Datasheets\R0402_Phycomp_RC0402.pdf; Author: CERN DEM JLC; CreateDate: 03.12.2007; LatestRevisionDate: 17.10.2012
R28 R99 R100 = R0402_2K2_1%_0.0625W_100PPM: Resistor - 1%; Part Description: General Purpose Thick Film Chip Resistor; Manufacturer: GENERIC; Manufacturer1 Part Number: 232270672202L; TC: ±100ppm/°C; Part Number: R0402_2K2_1%_0.0625W_100PPM; Component Kind: Standard; Component Type: Standard; Pin Count: 2; Value: 2k2; Status: Not recommended; Power: 0.0625W; Tolerance: ±1%; Manufacturer Part Number: R0402_2K2_1%_0.0625W_100PPM; Case: 0402; Mounted: Yes; Sense: No; Socket: No; SMD: Yes; Manufacturer1 Example: YAGEO PHYCOMP; Manufacturer1 ComponentHeight: 0.4mm; HelpURL: \\cern.ch\dfs\Applications\Altium\Datasheets\R0402_Phycomp_RC0402.pdf; Author: CERN DEM JLC; CreateDate: 03.12.2007; LatestRevisionDate: 17.10.2012
R30 R54 = R0603_33K_1%_0.1W_100PPM: Resistor - 1%; Part Description: General Purpose Thick Film Chip Resistor; Manufacturer: GENERIC; Manufacturer1 Part Number: NRC06F3302TRF; Power: 0.1W; TC: ±100ppm/°C; PressFit: No; Part Number: R0603_33K_1%_0.1W_100PPM; Component Kind: Standard; Component Type: Standard; Pin Count: 2; Value: 33k; Status: Preferred; Tolerance: ±1%; Manufacturer Part Number: R0603_33K_1%_0.1W_100PPM; Case: 0603; Mounted: Yes; Sense: No; Socket: No; SMD: Yes; Manufacturer1 Example: NIC COMPONENT; Manufacturer1 ComponentHeight: 0.55mm; HelpURL: \\cern.ch\dfs\Applications\Altium\Datasheets\R0603_NIC_NRC.pdf; Author: CERN DEM JLC; CreateDate: 03.12.2007; LatestRevisionDate: 13.03.2008
R31 R81 R124 = R0603_4K7_1%_0.1W_100PPM: Resistor - 1%; Part Description: General Purpose Thick Film Chip Resistor; Manufacturer: GENERIC; Manufacturer1 Part Number: NRC06F4701TRF; Power: 0.1W; TC: ±100ppm/°C; PressFit: No; Part Number: R0603_4K7_1%_0.1W_100PPM; Component Kind: Standard; Component Type: Standard; Pin Count: 2; Value: 4k7; Status: Preferred; Tolerance: ±1%; Manufacturer Part Number: R0603_4K7_1%_0.1W_100PPM; Case: 0603; Mounted: Yes; Sense: No; Socket: No; SMD: Yes; Manufacturer1 Example: NIC COMPONENT; Manufacturer1 ComponentHeight: 0.55mm; HelpURL: \\cern.ch\dfs\Applications\Altium\Datasheets\R0603_NIC_NRC.pdf; Author: CERN DEM JLC; CreateDate: 03.12.2007; LatestRevisionDate: 13.03.2008
R33 = R0603_82K_1%_0.1W_100PPM: Resistor - 1%; Part Description: General Purpose Thick Film Chip Resistor; Manufacturer: GENERIC; Manufacturer1 Part Number: NRC06F8202TRF; Power: 0.1W; TC: ±100ppm/°C; PressFit: No; Part Number: R0603_82K_1%_0.1W_100PPM; Component Kind: Standard; Component Type: Standard; Pin Count: 2; Value: 82k; Status: Preferred; Tolerance: ±1%; Manufacturer Part Number: R0603_82K_1%_0.1W_100PPM; Case: 0603; Mounted: Yes; Sense: No; Socket: No; SMD: Yes; Manufacturer1 Example: NIC COMPONENT; Manufacturer1 ComponentHeight: 0.55mm; HelpURL: \\cern.ch\dfs\Applications\Altium\Datasheets\R0603_NIC_NRC.pdf; Author: CERN DEM JLC; CreateDate: 03.12.2007; LatestRevisionDate: 13.03.2008
R48 = R0402_220R_1%_0.0625W_100PPM: Resistor - 1%; Part Description: General Purpose Thick Film Chip Resistor; Manufacturer: GENERIC; Manufacturer1 Part Number: 232270672201L; TC: ±100ppm/°C; PressFit: No; Part Number: R0402_220R_1%_0.0625W_100PPM; Component Kind: Standard; Component Type: Standard; Pin Count: 2; Value: 220; Status: Not Recommended; Power: 0.0625W; Tolerance: ±1%; Manufacturer Part Number: R0402_220R_1%_0.0625W_100PPM; Case: 0402; Mounted: Yes; Sense: No; Socket: No; SMD: Yes; Manufacturer1 Example: YAGEO PHYCOMP; Manufacturer1 ComponentHeight: 0.4mm; HelpURL: \\cern.ch\dfs\Applications\Altium\Datasheets\R0402_Phycomp_RC0402.pdf; Author: CERN DEM JLC; CreateDate: 03.12.2007; LatestRevisionDate: 17.10.2012
R55 R111 = R0402_3K9_1%_0.0625W_100PPM: Resistor - 1%; Part Description: General Purpose Thick Film Chip Resistor; Manufacturer: GENERIC; Manufacturer1 Part Number: 232270673902L; TC: ±100ppm/°C; PressFit: No; Part Number: R0402_3K9_1%_0.0625W_100PPM; Component Kind: Standard; Component Type: Standard; Pin Count: 2; Value: 3k9; Status: Not Recommended; Power: 0.0625W; Tolerance: ±1%; Manufacturer Part Number: R0402_3K9_1%_0.0625W_100PPM; Case: 0402; Mounted: Yes; Sense: No; Socket: No; SMD: Yes; Manufacturer1 Example: YAGEO PHYCOMP; Manufacturer1 ComponentHeight: 0.4mm; HelpURL: \\cern.ch\dfs\Applications\Altium\Datasheets\R0402_Phycomp_RC0402.pdf; Author: CERN DEM JLC; CreateDate: 03.12.2007; LatestRevisionDate: 17.10.2012
R82 R143 = R0603_1K5_1%_0.1W_100PPM: Resistor - 1%; Part Description: General Purpose Thick Film Chip Resistor; Manufacturer: GENERIC; Manufacturer1 Part Number: NRC06F1501TRF; Power: 0.1W; TC: ±100ppm/°C; PressFit: No; Part Number: R0603_1K5_1%_0.1W_100PPM; Component Kind: Standard; Component Type: Standard; Pin Count: 2; Value: 1k5; Status: Preferred; Tolerance: ±1%; Manufacturer Part Number: R0603_1K5_1%_0.1W_100PPM; Case: 0603; Mounted: Yes; Sense: No; Socket: No; SMD: Yes; Manufacturer1 Example: NIC COMPONENT; Manufacturer1 ComponentHeight: 0.55mm; HelpURL: \\cern.ch\dfs\Applications\Altium\Datasheets\R0603_NIC_NRC.pdf; Author: CERN DEM JLC; CreateDate: 03.12.2007; LatestRevisionDate: 13.03.2008
R86 = R0402_1K2_1%_0.0625W_100PPM: Resistor - 1%; Part Description: General Purpose Thick Film Chip Resistor; Manufacturer: GENERIC; Manufacturer1 Part Number: 232270671202L; TC: ±100ppm/°C; PressFit: No; Part Number: R0402_1K2_1%_0.0625W_100PPM; Component Kind: Standard; Component Type: Standard; Pin Count: 2; Value: 1k2; Status: Not Recommended; Power: 0.0625W; Tolerance: ±1%; Manufacturer Part Number: R0402_1K2_1%_0.0625W_100PPM; Case: 0402; Mounted: Yes; Sense: No; Socket: No; SMD: Yes; Manufacturer1 Example: YAGEO PHYCOMP; Manufacturer1 ComponentHeight: 0.4mm; HelpURL: \\cern.ch\dfs\Applications\Altium\Datasheets\R0402_Phycomp_RC0402.pdf; Author: CERN DEM JLC; CreateDate: 03/12/2007; LatestRevisionDate: 17/10/2012
R91 R110 = R0603_56K_1%_0.1W_100PPM: Resistor - 1%; Part Description: General Purpose Thick Film Chip Resistor; Manufacturer: GENERIC; Manufacturer1 Part Number: NRC06F5602TRF; Power: 0.1W; TC: ±100ppm/°C; Part Number: R0603_56K_1%_0.1W_100PPM; Component Kind: Standard; Component Type: Standard; Pin Count: 2; Value: 56k; Status: Preferred; Tolerance: ±1%; Manufacturer Part Number: R0603_56K_1%_0.1W_100PPM; Case: 0603; Mounted: Yes; Sense: No; Socket: No; SMD: Yes; Manufacturer1 Example: NIC COMPONENT; Manufacturer1 ComponentHeight: 0.55mm; HelpURL: \\cern.ch\dfs\Applications\Altium\Datasheets\R0603_NIC_NRC.pdf; Author: CERN DEM JLC; CreateDate: 03.12.2007; LatestRevisionDate: 13.03.2008
R94 R140 R141 = R0603_18K_1%_0.1W_100PPM: Resistor - 1%; Part Description: General Purpose Thick Film Chip Resistor; Manufacturer: GENERIC; Manufacturer1 Part Number: NRC06F1802TRF; Power: 0.1W; TC: ±100ppm/°C; Part Number: R0603_18K_1%_0.1W_100PPM; Component Kind: Standard; Component Type: Standard; Pin Count: 2; Value: 18k; Status: Preferred; Tolerance: ±1%; Manufacturer Part Number: R0603_18K_1%_0.1W_100PPM; Case: 0603; Mounted: Yes; Sense: No; Socket: No; SMD: Yes; Manufacturer1 Example: NIC COMPONENT; Manufacturer1 ComponentHeight: 0.55mm; HelpURL: \\cern.ch\dfs\Applications\Altium\Datasheets\R0603_NIC_NRC.pdf; Author: CERN DEM JLC; CreateDate: 03.12.2007; LatestRevisionDate: 13.03.2008
R95 = R0603_13K_1%_0.1W_100PPM: Resistor - 1%; Part Description: General Purpose Thick Film Chip Resistor; Manufacturer: GENERIC; Manufacturer1 Part Number: NRC06F1302TRF; Power: 0.1W; TC: ±100ppm/°C; Part Number: R0603_13K_1%_0.1W_100PPM; Component Kind: Standard; Component Type: Standard; Pin Count: 2; Value: 13k; Status: Preferred; Tolerance: ±1%; Manufacturer Part Number: R0603_13K_1%_0.1W_100PPM; Case: 0603; Mounted: Yes; Sense: No; Socket: No; SMD: Yes; Manufacturer1 Example: NIC COMPONENT; Manufacturer1 ComponentHeight: 0.55mm; HelpURL: \\cern.ch\dfs\Applications\Altium\Datasheets\R0603_NIC_NRC.pdf; Author: CERN DEM JLC; CreateDate: 03.12.2007; LatestRevisionDate: 13.03.2008
R96 = R0603_20K_1%_0.1W_100PPM: Resistor - 1%; Part Description: General Purpose Thick Film Chip Resistor; Manufacturer: GENERIC; Manufacturer1 Part Number: NRC06F2002TRF; Power: 0.1W; TC: ±100ppm/°C; Part Number: R0603_20K_1%_0.1W_100PPM; Component Kind: Standard; Component Type: Standard; Pin Count: 2; Value: 20k; Status: Preferred; Tolerance: ±1%; Manufacturer Part Number: R0603_20K_1%_0.1W_100PPM; Case: 0603; Mounted: Yes; Sense: No; Socket: No; SMD: Yes; Manufacturer1 Example: NIC COMPONENT; Manufacturer1 ComponentHeight: 0.55mm; HelpURL: \\cern.ch\dfs\Applications\Altium\Datasheets\R0603_NIC_NRC.pdf; Author: CERN DEM JLC; CreateDate: 03.12.2007; LatestRevisionDate: 13.03.2008
R97 = R0603_1K_1%_0.1W_100PPM: Resistor - 1%; Part Description: General Purpose Thick Film Chip Resistor; Manufacturer: GENERIC; Manufacturer1 Part Number: NRC06F1001TRF; Power: 0.1W; TC: ±100ppm/°C; Part Number: R0603_1K_1%_0.1W_100PPM; Component Kind: Standard; Component Type: Standard; Pin Count: 2; Value: 1k; Status: Preferred; Tolerance: ±1%; Manufacturer Part Number: R0603_1K_1%_0.1W_100PPM; Case: 0603; Mounted: Yes; Sense: No; Socket: No; SMD: Yes; Manufacturer1 Example: NIC COMPONENT; Manufacturer1 ComponentHeight: 0.55mm; HelpURL: \\cern.ch\dfs\Applications\Altium\Datasheets\R0603_NIC_NRC.pdf; Author: CERN DEM JLC; CreateDate: 03.12.2007; LatestRevisionDate: 13.03.2008
R98 = R0603_7K5_0.1%_0.063W_10PPM: Resistor - 0.1%; Part Description: Thin Film Chip Resistor; Manufacturer: GENERIC; Manufacturer1 Part Number: RN73C1J7K5BTDF; Power: 0.063W; TC: ±10ppm; Part Number: R0603_7K5_0.1%_0.063W_10PPM; Component Kind: Standard; Component Type: Standard; Pin Count: 2; Value: 7k5; Status: Not recommended; Tolerance: ±0.1%; Manufacturer Part Number: R0603_7K5_0.1%_0.063W_10PPM; Case: 0603; Mounted: Yes; Sense: No; Socket: No; SMD: Yes; Manufacturer1 Example: TYCO HOLSWORTHY; Manufacturer1 ComponentHeight: 0.5mm; HelpURL: \\cern.ch\dfs\Applications\Altium\Datasheets\R0603_Tyco_RN73.pdf; Author: CERN DEM JLC; CreateDate: 03.12.2007; LatestRevisionDate: 13.03.2008
R118 R125 = R0603_1K5_1%_0.1W_100PPM: Resistor - 1%; Part Description: General Purpose Thick Film Chip Resistor; Manufacturer: GENERIC; Manufacturer1 Part Number: NRC06F1501TRF; Power: 0.1W; TC: ±100ppm/°C; Part Number: R0603_1K5_1%_0.1W_100PPM; Component Kind: Standard; Component Type: Standard; Pin Count: 2; Value: 1k5; Status: Preferred; Tolerance: ±1%; Manufacturer Part Number: R0603_1K5_1%_0.1W_100PPM; Case: 0603; Mounted: Yes; Sense: No; Socket: No; SMD: Yes; Manufacturer1 Example: NIC COMPONENT; Manufacturer1 ComponentHeight: 0.55mm; HelpURL: \\cern.ch\dfs\Applications\Altium\Datasheets\R0603_NIC_NRC.pdf; Author: CERN DEM JLC; CreateDate: 03.12.2007; LatestRevisionDate: 13.03.2008
R142 = R0603_330R_1%_0.1W_100PPM: Resistor - 1%; Part Description: General Purpose Thick Film Chip Resistor; Manufacturer: GENERIC; Manufacturer1 Part Number: NRC06F3300TRF; Power: 0.1W; TC: ±100ppm/°C; Table: Resistors SMD; Part Number: R0603_330R_1%_0.1W_100PPM; Component Kind: Standard; Component Type: Standard; Pin Count: 2; Value: 330; Status: Preferred; Tolerance: ±1%; Manufacturer Part Number: R0603_330R_1%_0.1W_100PPM; Case: 0603; Mounted: Yes; Socket: No; SMD: Yes; Manufacturer1 Example: NIC COMPONENT; Manufacturer1 ComponentHeight: 0.55mm; HelpURL: \\cern.ch\dfs\Applications\Altium\Datasheets\R0603_NIC_NRC.pdf; Author: CERN DEM JLC; CreateDate: 2007-12-03; LatestRevisionDate: 2008-03-13
TP1 TP16 = SMD_PAD_1.27X1.27MM: Part Description: 1.27mm x 1.27mm PCB Copper Area (SMD Test Point); Mounted: No; Part Number: SMD_PAD_1.27X1.27MM; Component Kind: Standard (No BOM); Component Type: Standard (No BOM); Pin Count: 1; Family: Test Point; Socket: No; SMD: Yes; Sense: No; Status: None; ComponentHeight: 0mm; HelpURL: Undefined; Author: CERN DEM JLC; PackageDescription: 1.27mm x 1.27mm PCB Copper Area (SMD Test Point)
  TP1: CreateDate: 12.01.2008; LatestRevisionDate: 12.01.2008
  TP16: CreateDate: 12/01/2008; LatestRevisionDate: 12/01/2008